# Altium schematic sheet 06_FPGA_HSIO_B1.SchDoc
size A3; DocumentNumber: 6; SheetNumber: 6; SheetTotal: 21
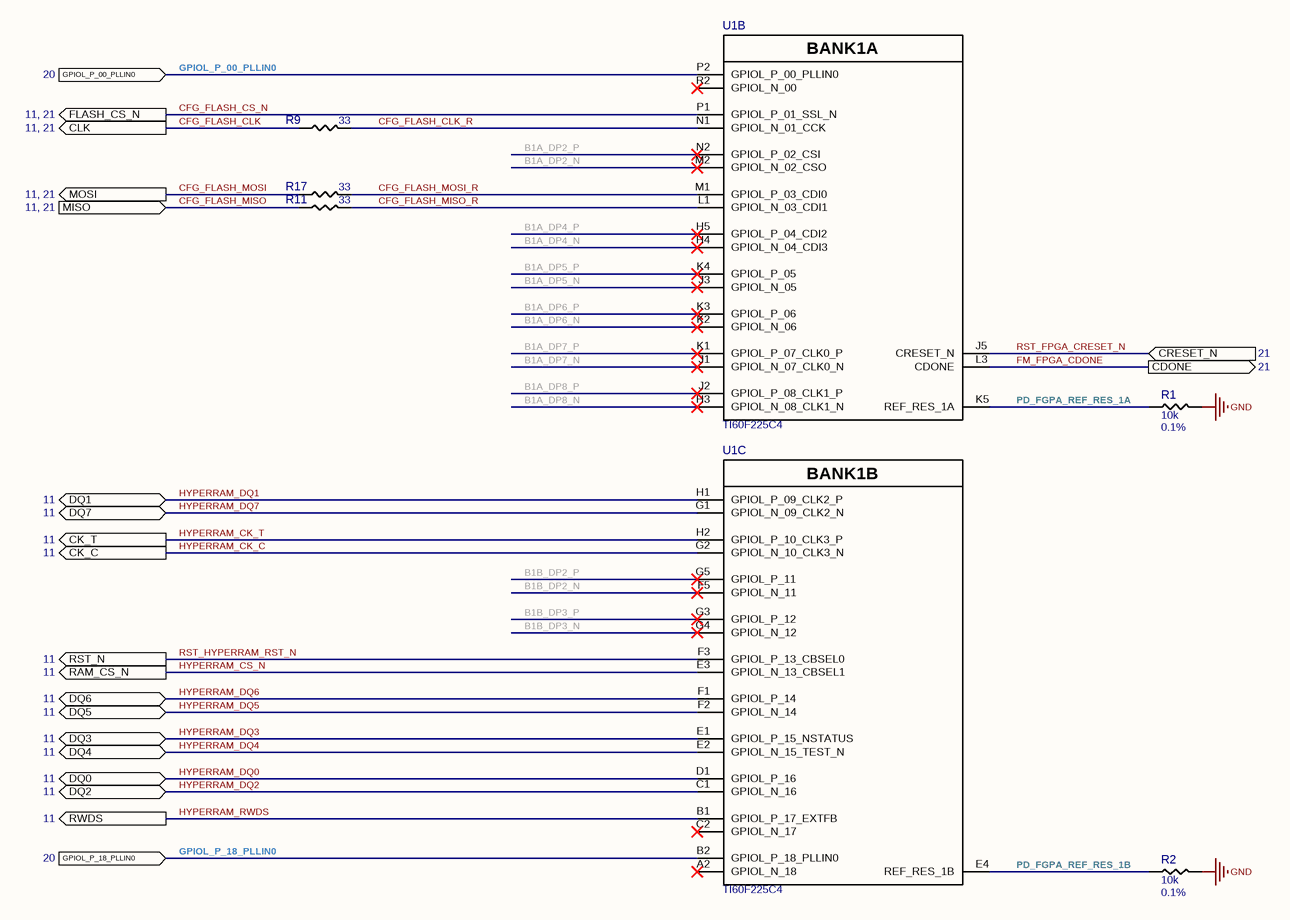
[diagram p0: 06_FPGA_HSIO_B1.SchDoc]

## Parts
R1  10k  Tol: 0.1%  [RESC1005X03N]
R2  10k  Tol: 0.1%  [RESC1005X03N]
R9  33  [RESC1005X03N]
R11  33  [RESC1005X03N]
R17  33  [RESC1005X03N]
U1  TI60F225C4  [BGA225C65P15X15_1000X1000X100]  (parts B,C of 13)

## Ports
CDONE (out, see 21), CK_C (out, see 11), CK_T (out, see 11), CLK (out, see 11, 21), CRESET_N (in, see 21), DQ0 (bidir, see 11), DQ1 (bidir, see 11), DQ2 (bidir, see 11), DQ3 (bidir, see 11), DQ4 (bidir, see 11), DQ5 (bidir, see 11), DQ6 (bidir, see 11), DQ7 (bidir, see 11), FLASH_CS_N (out, see 11, 21), GPIOL_P_00_PLLIN0 (in, see 20), GPIOL_P_18_PLLIN0 (in, see 20), MISO (in, see 11, 21), MOSI (out, see 11, 21), RAM_CS_N (out, see 11), RST_N (out, see 11), RWDS (out, see 11)

## Nets
GND: R1.2 R2.2
B1A_DP2_N: U1.M2(GPIOL_N_02_CSO)
B1A_DP2_P: U1.N2(GPIOL_P_02_CSI)
B1A_DP4_N: U1.H4(GPIOL_N_04_CDI3)
B1A_DP4_P: U1.H5(GPIOL_P_04_CDI2)
B1A_DP5_N: U1.J3(GPIOL_N_05)
B1A_DP5_P: U1.K4(GPIOL_P_05)
B1A_DP6_N: U1.K2(GPIOL_N_06)
B1A_DP6_P: U1.K3(GPIOL_P_06)
B1A_DP7_N: U1.J1(GPIOL_N_07_CLK0_N)
B1A_DP7_P: U1.K1(GPIOL_P_07_CLK0_P)
B1A_DP8_N: U1.H3(GPIOL_N_08_CLK1_N)
B1A_DP8_P: U1.J2(GPIOL_P_08_CLK1_P)
B1B_DP2_N: U1.F5(GPIOL_N_11)
B1B_DP2_P: U1.G5(GPIOL_P_11)
B1B_DP3_N: U1.G4(GPIOL_N_12)
B1B_DP3_P: U1.G3(GPIOL_P_12)
CFG_FLASH_CLK: R9.1 ; port CLK
CFG_FLASH_CLK_R: R9.2 U1.N1(GPIOL_N_01_CCK)
CFG_FLASH_CS_N: U1.P1(GPIOL_P_01_SSL_N) ; port FLASH_CS_N
CFG_FLASH_MISO: R11.1 ; port MISO
CFG_FLASH_MISO_R: R11.2 U1.L1(GPIOL_N_03_CDI1)
CFG_FLASH_MOSI: R17.1 ; port MOSI
CFG_FLASH_MOSI_R: R17.2 U1.M1(GPIOL_P_03_CDI0)
FM_FPGA_CDONE: U1.L3(CDONE) ; port CDONE
GPIOL_P_00_PLLIN0: U1.P2(GPIOL_P_00_PLLIN0) ; port GPIOL_P_00_PLLIN0
GPIOL_P_18_PLLIN0: U1.B2(GPIOL_P_18_PLLIN0) ; port GPIOL_P_18_PLLIN0
HYPERRAM_CK_C: U1.G2(GPIOL_N_10_CLK3_N) ; port CK_C
HYPERRAM_CK_T: U1.H2(GPIOL_P_10_CLK3_P) ; port CK_T
HYPERRAM_CS_N: U1.E3(GPIOL_N_13_CBSEL1) ; port RAM_CS_N
HYPERRAM_DQ0: U1.D1(GPIOL_P_16) ; port DQ0
HYPERRAM_DQ1: U1.H1(GPIOL_P_09_CLK2_P) ; port DQ1
HYPERRAM_DQ2: U1.C1(GPIOL_N_16) ; port DQ2
HYPERRAM_DQ3: U1.E1(GPIOL_P_15_NSTATUS) ; port DQ3
HYPERRAM_DQ4: U1.E2(GPIOL_N_15_TEST_N) ; port DQ4
HYPERRAM_DQ5: U1.F2(GPIOL_N_14) ; port DQ5
HYPERRAM_DQ6: U1.F1(GPIOL_P_14) ; port DQ6
HYPERRAM_DQ7: U1.G1(GPIOL_N_09_CLK2_N) ; port DQ7
HYPERRAM_RWDS: U1.B1(GPIOL_P_17_EXTFB) ; port RWDS
PD_FGPA_REF_RES_1A: R1.1 U1.K5(REF_RES_1A)
PD_FGPA_REF_RES_1B: R2.1 U1.E4(REF_RES_1B)
RST_FPGA_CRESET_N: U1.J5(CRESET_N) ; port CRESET_N
RST_HYPERRAM_RST_N: U1.F3(GPIOL_P_13_CBSEL0) ; port RST_N

Not connected (* = marked no-connect by the designer): U1 A2(GPIOL_N_18)* C2(GPIOL_N_17)* R2(GPIOL_N_00)*

## Notes on the sheet
- (in symbol TI60F225C4, part B) BANK1A
- (in symbol TI60F225C4, part C) BANK1B

## Library data of the parts
R1 R2 = RT0402BRD0710KL: RES SMD 10K OHM 0.1% 1/16W 0402; Manufacturer 1: Yageo; Part Number: RT0402BRD0710KL; Value: 10k; Manufacturer Part Number 1: RT0402BRD0710KL; Supplier 1: Digi-Key; Supplier Part Number 1: YAG1346CT-ND
R9 R11 R17 = RC0402FR-0733RL: RES SMD 33 OHM 1% 1/16W 0402; Manufacturer 1: Yageo; Part Number: RC0402FR-0733RL; Value: 33; Tol: 1%; Manufacturer Part Number 1: RC0402FR-0733RL; Supplier 1: Digi-Key; Supplier Part Number 1: 311-33.0LRCT-ND
U1 = TI60F225C4: FPGA TITAN 140HSIO 4PLL 225BGA; Manufacturer 1: Efinix, Inc.; Part Number: TI60F225C4; Manufacturer Part Number 1: TI60F225C4; Supplier 1: Digi-Key; Supplier Part Number 1: 2134-TI60F225C4-ND